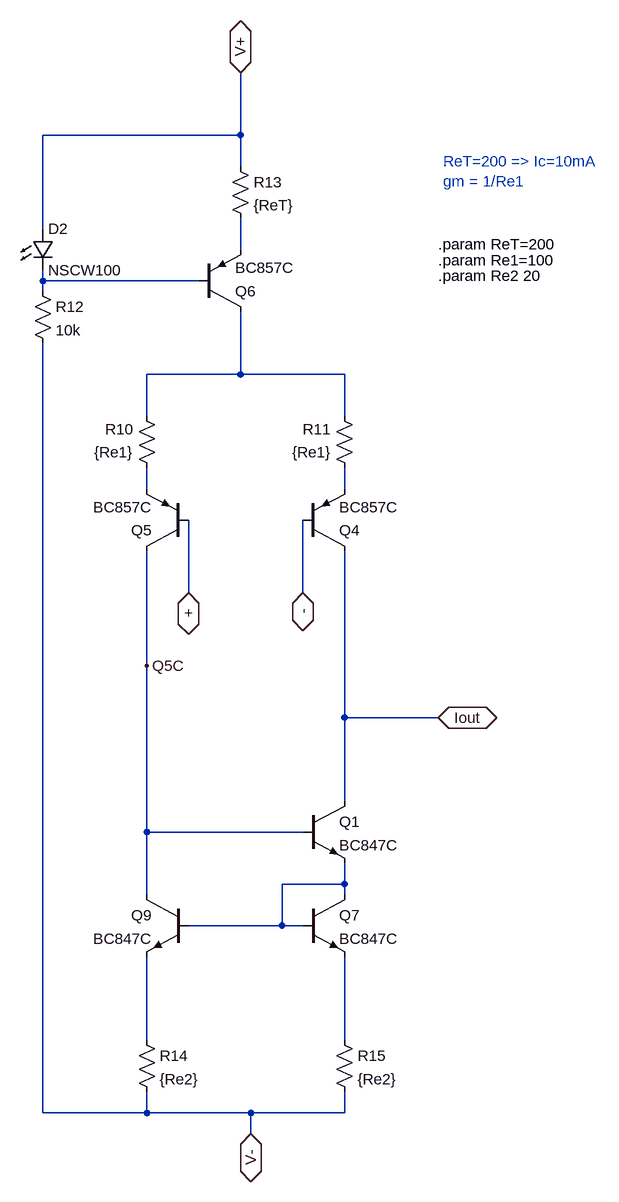
[diagram p0: schematic current-amp.asc]
current-amp.asc, the LTspice schematic file:
Version 4
SHEET 1 1708 680
WIRE -1216 -1312 -1216 -1408
WIRE -1216 -1312 -1520 -1312
WIRE -1216 -1264 -1216 -1312
WIRE -1520 -1168 -1520 -1312
WIRE -1216 -1136 -1216 -1184
WIRE -1520 -1088 -1520 -1104
WIRE -1280 -1088 -1520 -1088
WIRE -1520 -1072 -1520 -1088
WIRE -1216 -944 -1216 -1040
WIRE -1216 -944 -1360 -944
WIRE -1056 -944 -1216 -944
WIRE -1360 -880 -1360 -944
WIRE -1056 -880 -1056 -944
WIRE -1360 -768 -1360 -800
WIRE -1056 -768 -1056 -800
WIRE -1296 -608 -1296 -720
WIRE -1120 -608 -1120 -720
WIRE -1360 -496 -1360 -672
WIRE -1056 -416 -1056 -672
WIRE -912 -416 -1056 -416
WIRE -1056 -288 -1056 -416
WIRE -1360 -240 -1360 -496
WIRE -1120 -240 -1360 -240
WIRE -1056 -160 -1056 -192
WIRE -1056 -160 -1152 -160
WIRE -1360 -144 -1360 -240
WIRE -1056 -144 -1056 -160
WIRE -1152 -96 -1152 -160
WIRE -1152 -96 -1296 -96
WIRE -1120 -96 -1152 -96
WIRE -1360 80 -1360 -48
WIRE -1056 80 -1056 -48
WIRE -1520 192 -1520 -992
WIRE -1360 192 -1360 160
WIRE -1360 192 -1520 192
WIRE -1200 192 -1360 192
WIRE -1056 192 -1056 160
WIRE -1056 192 -1200 192
WIRE -1200 224 -1200 192
FLAG -1360 -496 Q5C
FLAG -1216 -1408 V+
IOPIN -1216 -1408 BiDir
FLAG -1200 224 V-
IOPIN -1200 224 BiDir
FLAG -912 -416 Iout
IOPIN -912 -416 BiDir
FLAG -1296 -608 +
IOPIN -1296 -608 BiDir
FLAG -1120 -608 -
IOPIN -1120 -608 BiDir
DATAFLAG -1360 -336 "Ic(Q5)"
DATAFLAG -1056 -496 "Ic(Q4)"
DATAFLAG -1360 -784 "I(R10)"
DATAFLAG -1056 -160 ""
DATAFLAG -1168 192 ""
SYMBOL pnp -1120 -672 M180
SYMATTR InstName Q4
SYMATTR Value BC857C
SYMBOL pnp -1296 -672 R180
SYMATTR InstName Q5
SYMATTR Value BC857C
SYMBOL res -1344 -784 R180
WINDOW 0 36 76 Left 2
WINDOW 3 36 40 Left 2
SYMATTR InstName R10
SYMATTR Value {Re1}
SYMBOL res -1040 -784 R180
WINDOW 0 36 76 Left 2
WINDOW 3 36 40 Left 2
SYMATTR InstName R11
SYMATTR Value {Re1}
SYMBOL pnp -1280 -1040 M180
SYMATTR InstName Q6
SYMATTR Value BC857C
SYMBOL LED -1536 -1168 R0
SYMATTR InstName D2
SYMATTR Value NSCW100
SYMATTR Description Diode
SYMATTR Type diode
SYMBOL res -1536 -1088 R0
SYMATTR InstName R12
SYMATTR Value 10k
SYMBOL res -1232 -1280 R0
SYMATTR InstName R13
SYMATTR Value {ReT}
SYMBOL res -1376 64 R0
SYMATTR InstName R14
SYMATTR Value {Re2}
SYMBOL res -1072 64 R0
SYMATTR InstName R15
SYMATTR Value {Re2}
SYMBOL npn -1120 -144 R0
SYMATTR InstName Q7
SYMATTR Value BC847C
SYMBOL npn -1296 -144 M0
SYMATTR InstName Q9
SYMATTR Value BC847C
SYMBOL npn -1120 -288 R0
SYMATTR InstName Q1
SYMATTR Value BC847C
TEXT -912 -1144 Left 2 !.param ReT=200
TEXT -912 -1120 Left 2 !.param Re1=100
TEXT -912 -1096 Left 2 !.param Re2 20
TEXT -904 -1272 Left 2 ;ReT=200 => Ic=10mA\ngm = 1/Re1

The netlist it stands for:
* current-amp.asc
Q4 Iout - N005 0 BC857C
Q5 Q5C + N004 0 BC857C
R10 N004 N003 {Re1}
R11 N005 N003 {Re1}
Q6 N003 N002 N001 0 BC857C
D2 V+ N002 NSCW100
R12 N002 V- 10k
R13 V+ N001 {ReT}
R14 N007 V- {Re2}
R15 N008 V- {Re2}
Q7 N006 N006 N008 0 BC847C
Q9 Q5C N006 N007 0 BC847C
Q1 Iout Q5C N006 0 BC847C
.model D D
.lib standard.dio
.model NPN NPN
.model PNP PNP
.lib standard.bjt
.param ReT=200
.param Re1=100
.param Re2 20
* ReT=200 => Ic=10mA
* gm = 1/Re1
.backanno
.end